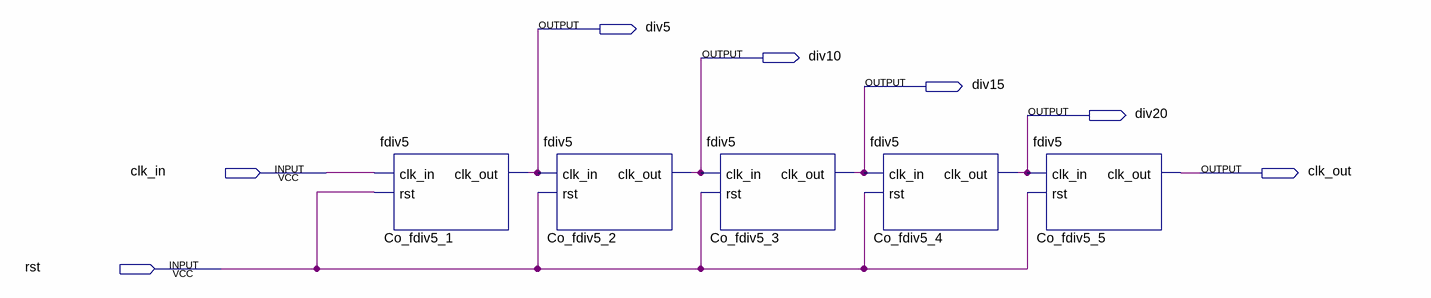
[diagram p0: schematic sheet]
// Quartus schematic test_fdivisor.bdf as structural Verilog: 5 symbols, 7 pins
module test_fdivisor (
  input  clk_in,
  input  rst,
  output div5,
  output div10,
  output div15,
  output div20,
  output clk_out
);

  fdiv5 Co_fdiv5_1 (.clk_in(clk_in), .rst(rst), .clk_out(div5));
  fdiv5 Co_fdiv5_2 (.clk_in(div5), .rst(rst), .clk_out(div10));
  fdiv5 Co_fdiv5_3 (.clk_in(div10), .rst(rst), .clk_out(div15));
  fdiv5 Co_fdiv5_4 (.clk_in(div15), .rst(rst), .clk_out(div20));
  fdiv5 Co_fdiv5_5 (.clk_in(div20), .rst(rst), .clk_out(clk_out));
endmodule
